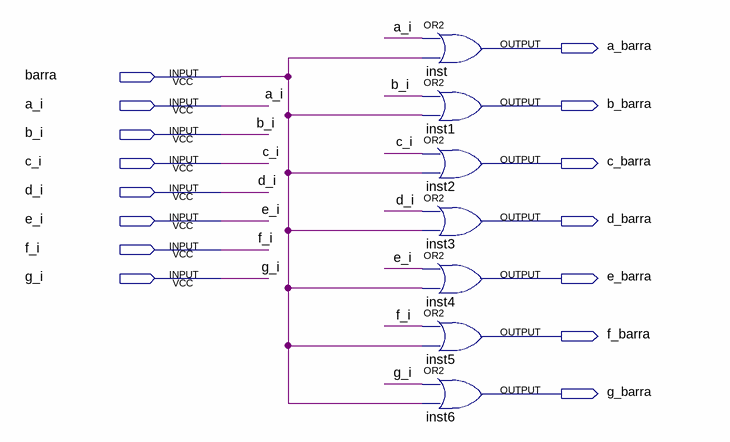
[diagram p0: schematic sheet]
// Quartus schematic output_barrado.bdf as structural Verilog: 7 symbols, 15 pins
module output_barrado (
  input  barra,
  input  a_i,
  input  b_i,
  input  c_i,
  input  d_i,
  input  e_i,
  input  f_i,
  input  g_i,
  output a_barra,
  output b_barra,
  output c_barra,
  output d_barra,
  output e_barra,
  output f_barra,
  output g_barra
);

  or inst (a_barra, a_i, barra);
  or inst1 (b_barra, b_i, barra);
  or inst2 (c_barra, c_i, barra);
  or inst3 (d_barra, d_i, barra);
  or inst4 (e_barra, e_i, barra);
  or inst5 (f_barra, f_i, barra);
  or inst6 (g_barra, g_i, barra);
endmodule
